# Altium schematic sheet FPGA_Countdown.SchDoc: LiveDesign Evaluation - Countdown
size A3; Organization: Altium Limited; Address1: L3, 12a Rodborough Rd; Address2: Frenchs Forest; Address3: NSW; Address4: Australia 2086; DocumentNumber: 1; SheetNumber: 1; SheetTotal: 3
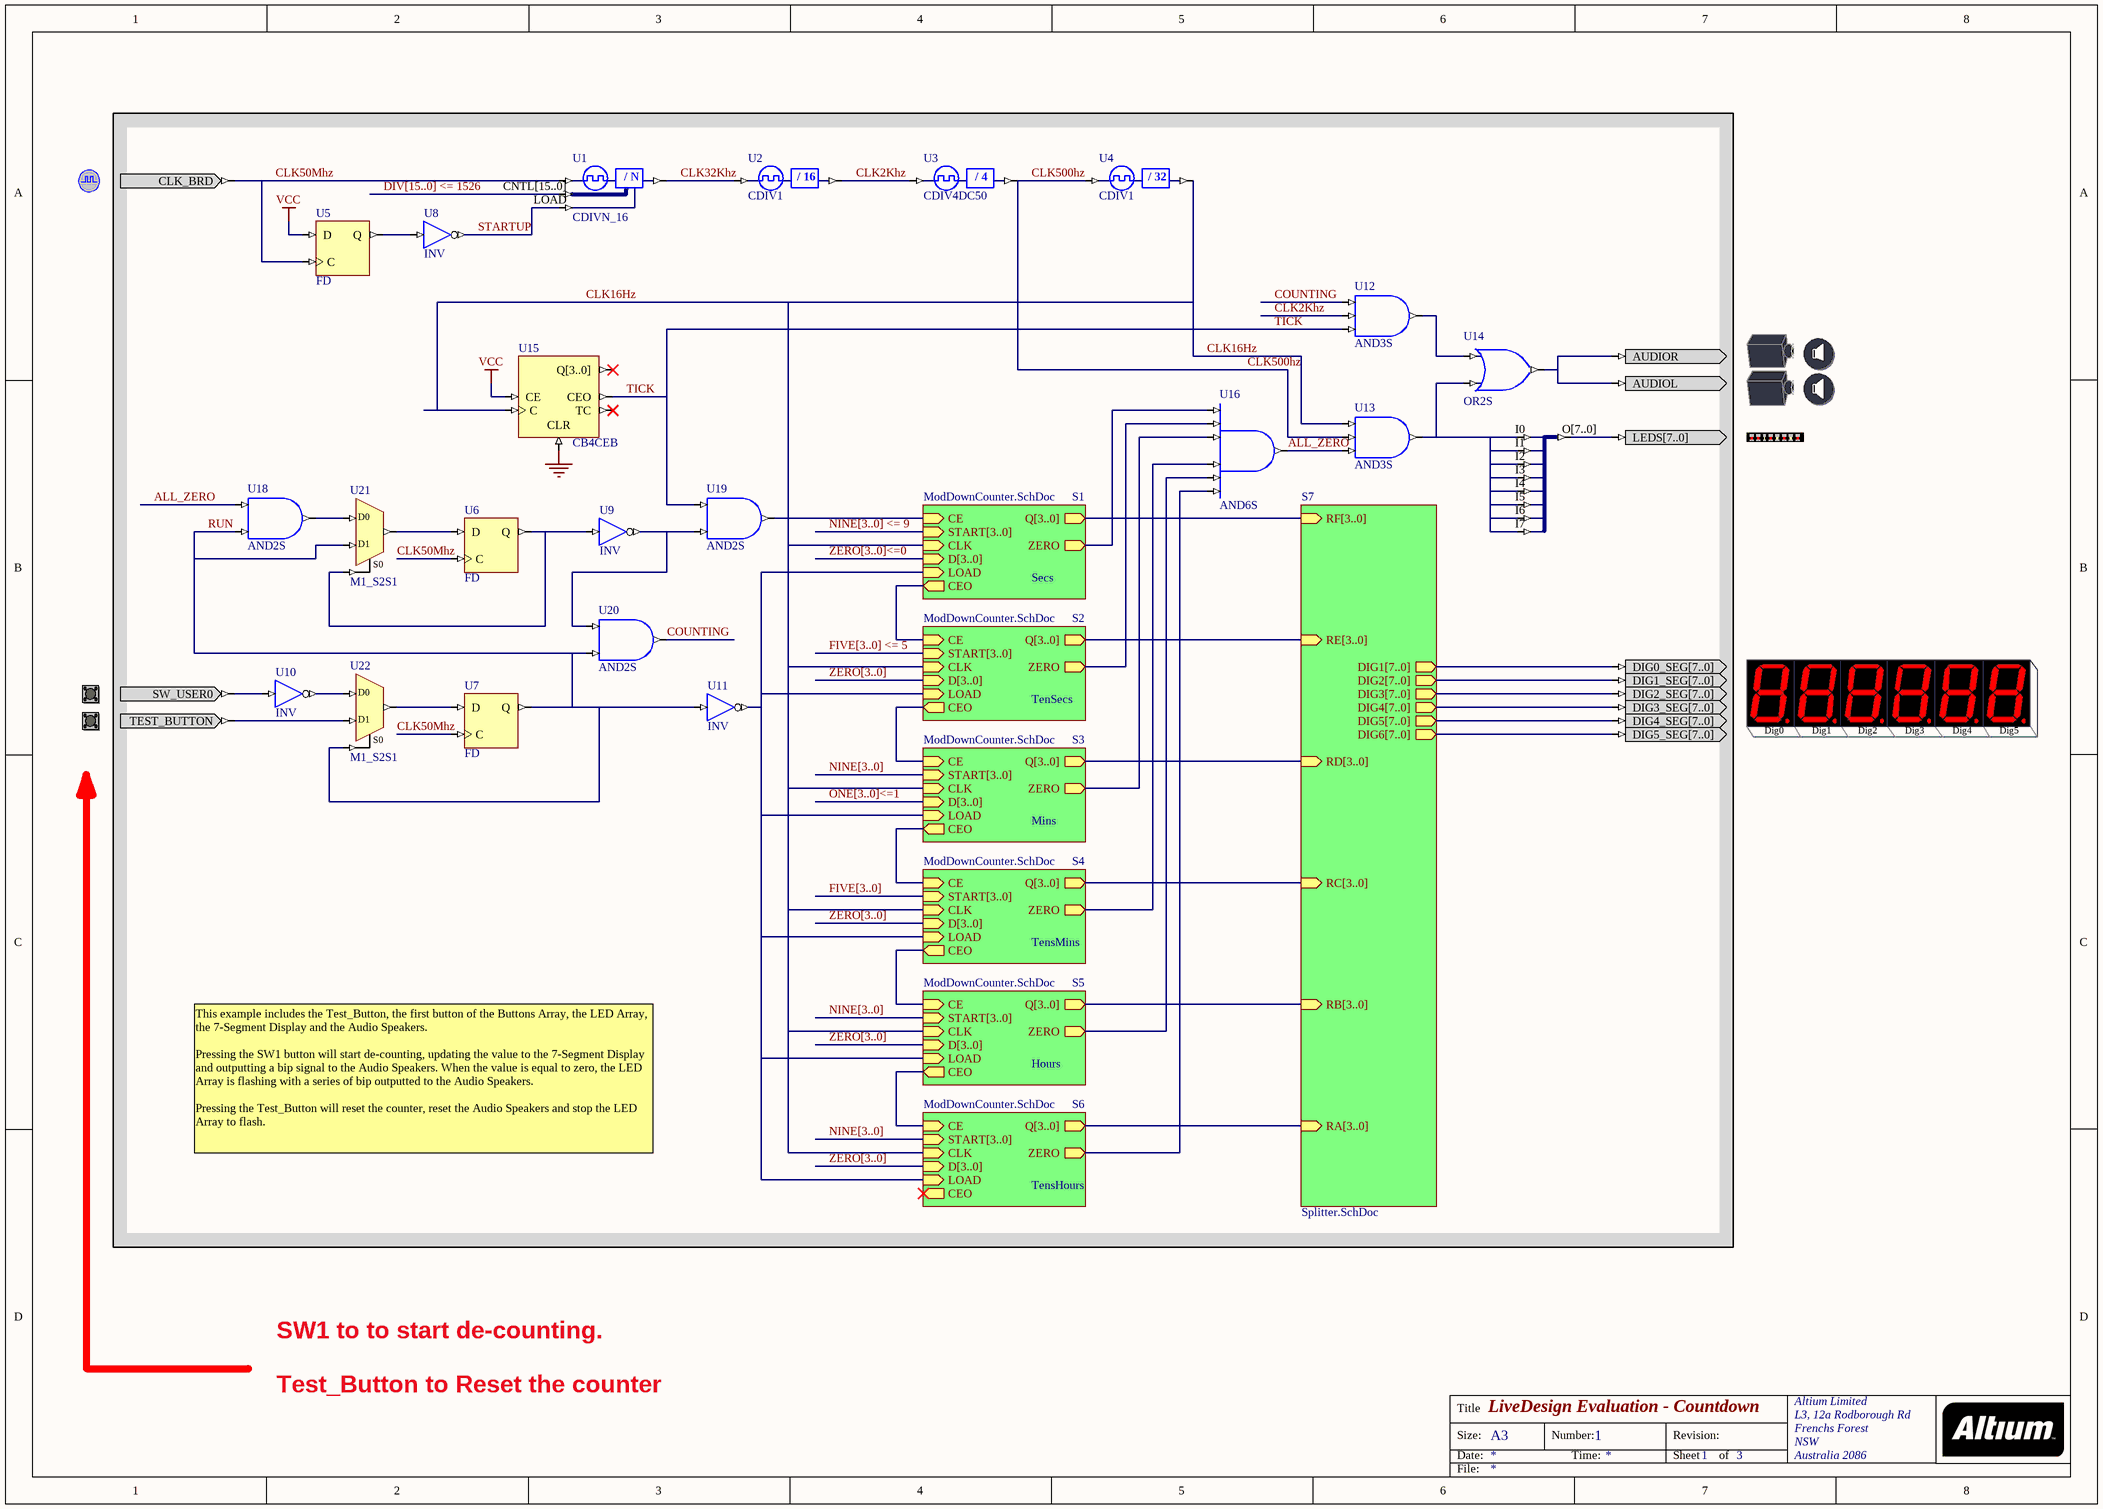
[diagram p0: FPGA_Countdown.SchDoc]

## Parts
(Parts that share a designator on the sheet are numbered #1, #2 ... from top to bottom, then left to right.)
?#1  CLOCK_BOARD  (value not drawn)
?#2  STEREO  (value not drawn)
?#3  LED  (value not drawn)
?#4  7SEGX6  (value not drawn)
?#5  USER_BUTTON0  (value not drawn)
?#6  TEST_BUTTON  (value not drawn)
U1  CDIVN_16
U2  CDIV1
U3  CDIV4DC50
U4  CDIV1
U5  FD
U6  FD
U7  FD
U8  INV
U9  INV
U10  INV
U11  INV
U12  AND3S
U13  AND3S
U14  OR2S
U15  CB4CEB
U16  AND6S
U17  J8S_8B  (value not drawn)
U18  AND2S
U19  AND2S
U20  AND2S
U21  M1_S2S1
U22  M1_S2S1

## Sub-sheets
S1 = ModDownCounter.SchDoc: START[3..0] (in), CLK (in), CEO (out), Q[3..0] (out), D[3..0] (in), LOAD (in), CE (in), ZERO (out)
S2 = ModDownCounter.SchDoc: START[3..0] (in), CLK (in), CEO (out), Q[3..0] (out), D[3..0] (in), LOAD (in), CE (in), ZERO (out)
S3 = ModDownCounter.SchDoc: START[3..0] (in), CLK (in), CEO (out), Q[3..0] (out), D[3..0] (in), LOAD (in), CE (in), ZERO (out)
S4 = ModDownCounter.SchDoc: START[3..0] (in), CLK (in), CEO (out), Q[3..0] (out), D[3..0] (in), LOAD (in), CE (in), ZERO (out)
S5 = ModDownCounter.SchDoc: START[3..0] (in), CLK (in), CEO (out), Q[3..0] (out), D[3..0] (in), LOAD (in), CE (in), ZERO (out)
S6 = ModDownCounter.SchDoc: START[3..0] (in), CLK (in), CEO (out), Q[3..0] (out), D[3..0] (in), LOAD (in), CE (in), ZERO (out)
S7 = Splitter.SchDoc: DIG1[7..0] (out), DIG2[7..0] (out), DIG3[7..0] (out), DIG4[7..0] (out), DIG5[7..0] (out), DIG6[7..0] (out), RA[3..0] (in), RB[3..0] (in), RC[3..0] (in), RD[3..0] (in), RE[3..0] (in), RF[3..0] (in)

## Nets
GND: U15.CLR
VCC: U5.D U15.CE
ALL_ZERO: U13.I2 U16.O U18.I0
CLK2Khz: U2.CLKDV U3.CLKIN U12.I1
CLK16Hz: U4.CLKDV U13.I0 U15.C ; sheet S1/CLK, sheet S2/CLK, sheet S3/CLK, sheet S4/CLK, sheet S5/CLK, sheet S6/CLK
CLK32Khz: U1.CLKDV U2.CLKIN
CLK50Mhz: ?#1.CLK_BRD U1.CLKIN U5.C U6.C U7.C
CLK500hz: U3.CLKDV U4.CLKIN U13.I1
COUNTING: U12.I0 U20.O
DIV[15..0] <= 1526: U1.CNTL[15..0]
RUN: U7.Q U11.I U18.I1 U20.I1 U21.D1 U22.S0
STARTUP: U1.LOAD U8.O
TICK: U12.I2 U15.CEO U19.I1
Net?#2_AUDIOL: ?#2.AUDIOL ?#2.AUDIOR U14.O
Net?#3_LEDS[7..0]: ?#3.LEDS[7..0] U17.O[7..0]
Net?#4_DIG0_SEG[7..0]: ?#4.DIG0_SEG[7..0] ; sheet S7/DIG1[7..0]
Net?#4_DIG1_SEG[7..0]: ?#4.DIG1_SEG[7..0] ; sheet S7/DIG2[7..0]
Net?#4_DIG2_SEG[7..0]: ?#4.DIG2_SEG[7..0] ; sheet S7/DIG3[7..0]
Net?#4_DIG3_SEG[7..0]: ?#4.DIG3_SEG[7..0] ; sheet S7/DIG4[7..0]
Net?#4_DIG4_SEG[7..0]: ?#4.DIG4_SEG[7..0] ; sheet S7/DIG5[7..0]
Net?#4_DIG5_SEG[7..0]: ?#4.DIG5_SEG[7..0] ; sheet S7/DIG6[7..0]
Net?#5_SW_USER0: ?#5.SW_USER0 U10.I
Net?#6_TEST_BUTTON: ?#6.TEST_BUTTON U22.D1
NetU5_Q: U5.Q U8.I
NetU6_D: U6.D U21.O
NetU6_Q: U6.Q U9.I U21.S0
NetU7_D: U7.D U22.O
NetU9_O: U9.O U19.I0 U20.I0
NetU10_O: U10.O U22.D0
NetU11_O: U11.O ; sheet S1/LOAD, sheet S2/LOAD, sheet S3/LOAD, sheet S4/LOAD, sheet S5/LOAD, sheet S6/LOAD
NetU12_O: U12.O U14.I0
NetU13_O: U13.O U14.I1 U17.I0 U17.I1 U17.I2 U17.I3 U17.I4 U17.I5 U17.I6 U17.I7
NetU16_I0: U16.I0 ; sheet S1/ZERO
NetU16_I1: U16.I1 ; sheet S2/ZERO
NetU16_I2: U16.I2 ; sheet S3/ZERO
NetU16_I3: U16.I3 ; sheet S4/ZERO
NetU16_I4: U16.I4 ; sheet S5/ZERO
NetU16_I5: U16.I5 ; sheet S6/ZERO
NetU18_O: U18.O U21.D0
NetU19_O: U19.O ; sheet S1/CE
(unnamed): sheet S1/CEO, sheet S2/CE
(unnamed): sheet S2/CEO, sheet S3/CE
(unnamed): sheet S3/CEO, sheet S4/CE
(unnamed): sheet S4/CEO, sheet S5/CE
(unnamed): sheet S5/CEO, sheet S6/CE

Not connected (* = marked no-connect by the designer): U15 Q[3..0]* TC*

## Buses and harness runs
bus DIV[15..0] <= 1526
bus FIVE[3..0] <= 5 = sheet S2/START[3..0]
bus FIVE[3..0] = sheet S4/START[3..0]
bus NINE[3..0] <= 9 = sheet S1/START[3..0]
bus NINE[3..0] = sheet S3/START[3..0]
bus NINE[3..0] = sheet S5/START[3..0]
bus NINE[3..0] = sheet S6/START[3..0]
bus ONE[3..0]<=1 = sheet S3/D[3..0]
bus sheet S1/Q[3..0] = sheet S7/RF[3..0]
bus sheet S2/Q[3..0] = sheet S7/RE[3..0]
bus sheet S3/Q[3..0] = sheet S7/RD[3..0]
bus sheet S4/Q[3..0] = sheet S7/RC[3..0]
bus sheet S5/Q[3..0] = sheet S7/RB[3..0]
bus sheet S6/Q[3..0] = sheet S7/RA[3..0]
bus ZERO[3..0] = sheet S2/D[3..0]
bus ZERO[3..0] = sheet S4/D[3..0]
bus ZERO[3..0] = sheet S5/D[3..0]
bus ZERO[3..0] = sheet S6/D[3..0]
bus ZERO[3..0]<=0 = sheet S1/D[3..0]

## Notes on the sheet
- Secs
- TenSecs
- Mins
- TensMins
- Hours
- This example includes the Test_Button, the first button of the Buttons Array, the LED Array, the 7-Segment Display and the Audio Speakers.
  Pressing the SW1 button will start de-counting, updating the value to the 7-Segment Display and outputting a bip signal to the Audio Speakers. When the value is equal to zero, the LED Array is flashing with a series of bip outputted to the Audio Speakers.
  Pressing the Test_Button will reset the counter, reset the Audio Speakers and stop the LED Array to flash.
- TensHours
- SW1 to to start de-counting.
  Test_Button to Reset the counter
- Title
- Size:
- Date:
- A3
- Number:
- Time:
- Revision:
- Sheet
- of
- File:
- (in symbol 7SEGX6) Dig0; Dig1; Dig2; Dig3; Dig4; Dig5
- (in symbol CDIV4DC50) / 4
- (in symbol CDIV16DC50) / 16
- (in symbol CDIV32DC50) / 32
- (in symbol CDIVN_16) / N

## Library data of the parts
?#1 = CLOCK_BOARD: Global System Clock Supply; PortComponent: True; Published: 19-Nov-2003; Publisher: Altium Limited
?#2 = STEREO: Sound interface; PortComponent: True; Published: 19-Nov-2003; Publisher: Altium Limited
?#3 = LED: 8-Way LEDS; PortComponent: True; Published: 19-Nov-2003; Publisher: Altium Limited
?#4 = 7SEGX6: 6 x 7 Segment display module; PortComponent: True; Publisher: Altium Limited; Published: 9-Sept-2004
?#5 = USER_BUTTON0: User Buttons; PortComponent: True; Published: 19-Nov-2003; Publisher: Altium Limited
?#6 = TEST_BUTTON: Test Button; PortComponent: True; Published: 19-Nov-2003; Publisher: Altium Limited
U1 = CDIVN_16: 16-Bit Programmable Clock Divider; ArchiveName: GENERIC; VHDLIB_SIM: GENERIC_LIB; Published: 29-Jan-2004; Publisher: Altium Limited; Core Revision: 1.00.00
U2 = CDIV16DC50: Clock Divider by 16 with 50% Duty Cycle Output; ArchiveName: GENERIC; VHDLIB_SIM: GENERIC_LIB; Xilinx Equivalent: CLK_DIV16; Published: 29-Jan-2004; Publisher: Altium Limited; Core Revision: 1.00.00
U3 = CDIV4DC50: Clock Divider by 4 with 50% Duty Cycle Output; ArchiveName: GENERIC; VHDLIB_SIM: GENERIC_LIB; Xilinx Equivalent: CLK_DIV4; Published: 29-Jan-2004; Publisher: Altium Limited; Core Revision: 1.00.00
U4 = CDIV32DC50: Clock Divider by 32 with 50% Duty Cycle Output; ArchiveName: GENERIC; VHDLIB_SIM: GENERIC_LIB; Published: 29-Jan-2004; Publisher: Altium Limited; Core Revision: 1.00.00
U5-U7 = FD: D-Type Flip-Flop; ArchiveName: GENERIC; VHDLIB_SIM: GENERIC_LIB; Published: 29-Jan-2004; Publisher: Altium Limited; Xilinx Equivalent: FD; Core Revision: 1.00.00
U8-U11 = INV: Inverter; ArchiveName: GENERIC; VHDLIB_SIM: GENERIC_LIB; Published: 29-Jan-2004; Publisher: Altium Limited; Xilinx Equivalent: INV; Core Revision: 1.00.00
U12 U13 = AND3S: 3-Input AND Gate, Single Pin Version; ArchiveName: GENERIC; VHDLIB_SIM: GENERIC_LIB; Xilinx Equivalent: AND3; Published: 29-Jan-2004; Publisher: Altium Limited; Core Revision: 1.00.00
U14 = OR2S: 2-Input OR Gate, Single Pin Version; ArchiveName: GENERIC; VHDLIB_SIM: GENERIC_LIB; Xilinx Equivalent: OR2; Published: 29-Jan-2004; Publisher: Altium Limited; Core Revision: 1.00.00
U15 = CB4CEB: 4-Bit Cascadable Binary Counters with Clock Enable and Asynchronous Clear, Bus Version; ArchiveName: GENERIC; VHDLIB_SIM: GENERIC_LIB; Published: 29-Jan-2004; Publisher: Altium Limited; Core Revision: 1.00.00
U16 = AND6S: 6-Input AND Gate, Single Pin Version; ArchiveName: GENERIC; VHDLIB_SIM: GENERIC_LIB; Xilinx Equivalent: AND6; Published: 29-Jan-2004; Publisher: Altium Limited; Core Revision: 1.00.00
U17 = J8S_8B: 8 Single pin inputs to single 8-Bit output bus; ArchiveName: GENERIC; VHDLIB_SIM: GENERIC_LIB; Published: 29-Jan-2004; Publisher: Altium Limited; Core Revision: 1.00.00
U18-U20 = AND2S: 2-Input AND Gate, Single Pin Version; ArchiveName: GENERIC; VHDLIB_SIM: GENERIC_LIB; Xilinx Equivalent: AND2; Published: 29-Jan-2004; Publisher: Altium Limited; Core Revision: 1.00.00
U21 U22 = M1_S2S1: 2x1-Single Wire to 1x1-Single Wire Multiplexer; ArchiveName: GENERIC; VHDLIB_SIM: GENERIC_LIB; Xilinx Equivalent: M2_1; Published: 29-Jan-2004; Publisher: Altium Limited; Core Revision: 1.00.00